# Altium schematic sheet Power_management.SchDoc
size A
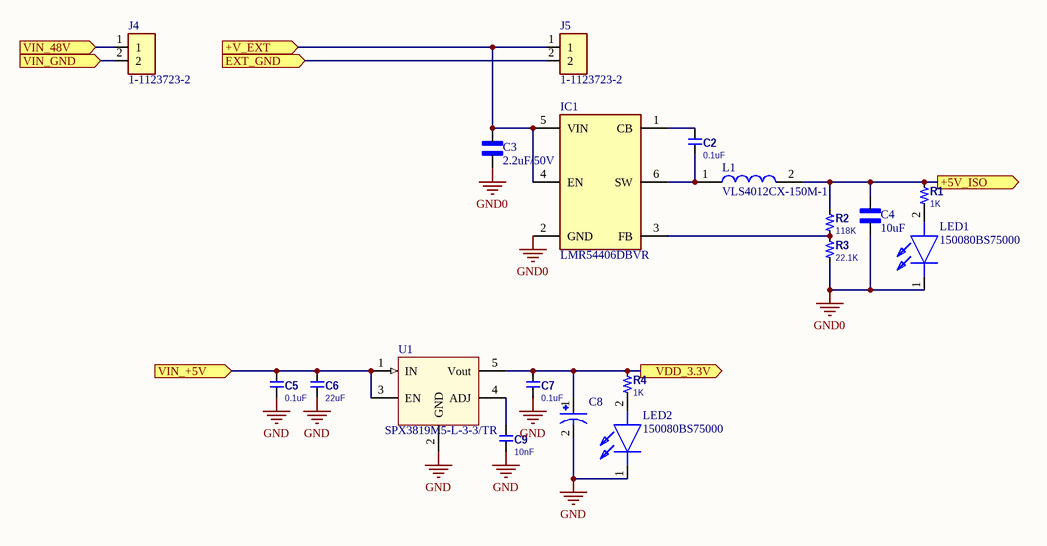
[diagram p0: Power_management.SchDoc]

## Parts
C2  0.1uF  [0603-C]
C3  2.2uF/50V  [0805_C]
C4  10uF  [0805_C]
C5  0.1uF  [0603-C]
C6  22uF  [0603-C]
C7  0.1uF  [0603-C]
C8  T493X227K010BH6420_220uF  [CAPPM7343X430N]  (value not drawn)
C9  10nF  [0603-C]
IC1  LMR54406DBVR  [SOT95P280X145-6N]
J4  1-1123723-2  [TE_1-1123723-2]
J5  1-1123723-2  [TE_1-1123723-2]
L1  VLS4012CX-150M-1  [VLS4012]
LED1  150080BS75000  [LEDC2012X80N]
LED2  150080BS75000  [LEDC2012X80N]
R1  1K  [0603-R]
R2  118K  [0603-R]
R3  22.1K  [0603-R]
R4  1K  [0603-R]
U1  SPX3819M5-L-3-3/TR  [SOT23-5]

## Ports
+5V_ISO (out), +V_EXT (in), EXT_GND (in), VDD_3.3V (out), VIN_48V (in), VIN_+5V (in), VIN_GND (in)

## Nets
GND: C5.2 C6.2 C7.2 C8.2 C9.2 LED2.1(K) U1.2(GND)
GND0: C3.2 C4.2 IC1.2(GND) LED1.1(K) R3.1
+5V_ISO: C4.1 L1.2 R1.2 R2.2 ; port +5V_ISO
+V_EXT: C3.1 IC1.4(EN) IC1.5(VIN) J5.1 ; port +V_EXT
EXT_GND: J5.2 ; port EXT_GND
VDD_3.3V: C7.1 C8.1 R4.2 U1.5(Vout) ; port VDD_3.3V
VIN_48V: J4.1 ; port VIN_48V
VIN_+5V: C5.1 C6.1 U1.1(IN) U1.3(EN) ; port VIN_+5V
VIN_GND: J4.2 ; port VIN_GND
NetC2_1: C2.1 IC1.1(CB)
NetC2_2: C2.2 IC1.6(SW) L1.1
NetC9_1: C9.1 U1.4(ADJ)
NetIC1_3: IC1.3(FB) R2.1 R3.2
NetLED1_2: LED1.2(A) R1.1
NetLED2_2: LED2.2(A) R4.1

## Library data of the parts
C2 C5-C7 C9 = CAP: Manufacturer: TDK EPCOS; Manufacturer Part Number: B37941K9105K62; Capacitance: 1uF; Voltage Rating: 16V; Tolerance: 10%; ComponentLink1URL: https://datasheet.ciiva.com/13389/upy-gphc-y5v-6-3v-to-50v-5-13389978.pdf?src-supplier=Mouser; ComponentLink1Description: Datasheet; Supplier 1: Digi-Key; RoHS: Yes; Category: Ceramic Capacitors; Mount: Surface Mount; Case/Package: 0805; Case Code (Metric): 2012; Case Code (Imperial): 0805; Min Operating Temperature: -55°C; Max Operating Temperature: 125°C; Package Quantity: 3000; Packaging: Tape and Reel; Voltage Rating (DC): 16V; Length: 0.079inch; Width: 0.049inch; Height: 1.35mm; Thickness: 0.049inch; Ratings: AEC-Q200; Lead Free: Lead Free; ComponentLink2URL: http://components.arrow.com/part/dataview/0323_01879911?src-supplier=Arrow+Europe; ComponentLink2Description: http://components.arrow.com/part/dataview/0323_01879911?src-supplier=Arrow+Europe; ComponentLink3URL: https://media.digikey.com/pdf/Data%20Sheets/Epcos%20PDFs/B37872K_B37941K_Series.pdf?src-supplier=Digi-Key; ComponentLink3Description: https://media.digikey.com/pdf/Data%20Sheets/Epcos%20PDFs/B37872K_B37941K_Series.pdf?src-supplier=Digi-Key; Supplier Part Number 1: 495-1935-1-ND
C3 C4 = CAP: MP: LD03ZD475MAB2A; Package: None; Price: None; Value: *; Availability: Unavailable
C8 = T493X227K010BH6420_220uF: MF: Kemet; Value: *; MP: T493X227K010BH6420; Package: SMD-2 Kemet; Availability: In Stock; Check_prices: https://www.snapeda.com/parts/T493X227K010BH6420/Kemet/view-part/?ref=eda; SnapEDA_Link: https://www.snapeda.com/parts/T493X227K010BH6420/Kemet/view-part/?ref=snap; Price: None
IC1 = LMR54406DBVR: Integrated Circuit; Manufacturer_Name: Texas Instruments; Datasheet Link: https://www.ti.com/lit/ds/symlink/lmr54406.pdf?ts=1659688249350&ref_url=https%253A%252F%252Fwww.ti.com%252Fproduct%252FLMR54406%252Fpart-details%252FLMR54406DBVR; Height: 1.45mm; Manufacturer_Part_Number: LMR54406DBVR; Mouser Part Number: 595-LMR54406DBVR; Mouser Price/Stock: https://www.mouser.co.uk/ProductDetail/Texas-Instruments/LMR54406DBVR?qs=rSMjJ%252B1ewcQLNU8KVBwgHQ%3D%3D; Arrow Part Number: LMR54406DBVR; Arrow Price/Stock: https://www.arrow.com/en/products/lmr54406dbvr/texas-instruments?region=nac
J4 J5 = 1-1123723-2: 3.96 EP HDR ASSY 2P_NATURAL_; Number_of_Positions: 2; MF: TE Connectivity; Product_Type: Header; Centerline_Pitch: 3.96 mm[.156 in]; EU_RoHS_Compliance: Compliant; Value: *; TE_purchase_URL: https://www.te.com/usa-en/product-1-1123723-2.html?te_bu=Cor&te_type=disp&te_campaign=seda_glo_cor-seda-global-disp-prtnr-fy19-seda-model-bom-cta_sma-317_1&elqCampaignId=32493; SnapEDA_Link: https://www.snapeda.com/parts/1-1123723-2/TE%20Connectivity%20AMP%20Connectors/view-part/231687/?ref=snap; Package: None; MP: 1-1123723-2; Digi-Key_Purchase_URL: https://www.digikey.com/product-detail/en/te-connectivity-amp-connectors/1-1123723-2/A111830-ND/686925?utm_source=snapeda&utm_medium=aggregator&utm_campaign=symbol; Digi-Key_Part_Number: A111830-ND
L1 = VLS4012CX-150M-1: Inductor; Manufacturer_Name: TDK; Datasheet Link: https://product.tdk.com/system/files/dam/doc/product/inductor/inductor/smd/catalog/inductor_commercial_power_vls4012cx-1_en.pdf; Manufacturer_Part_Number: VLS4012CX-150M-1; Mouser Part Number: 810-VLS4012CX150M1; Mouser Price/Stock: https://www.mouser.co.uk/ProductDetail/TDK/VLS4012CX-150M-1?qs=sPbYRqrBIVl6JuB3PiTP7w%3D%3D
LED1 LED2 = 150080BS75000: LED; Manufacturer_Name: Wurth Elektronik; Datasheet Link: https://katalog.we-online.com/led/datasheet/150080BS75000.pdf; Height: 0.8mm; Manufacturer_Part_Number: 150080BS75000; Mouser Part Number: 710-150080BS75000; Mouser Price/Stock: https://www.mouser.co.uk/ProductDetail/Wurth-Elektronik/150080BS75000?qs=2kOmHSv6VfT2tBo3UPVqAQ%3D%3D
R1-R4 = Res_2: Manufacturer: Panasonic; Manufacturer Part Number: ERJ-8GEYJ621V; Resistance: 620R; Tolerance: 5%; Voltage Rating: 200V; Temperature Coefficient: 200ppm/°C; Max Power Dissipation: 250mW; ComponentLink1URL: https://datasheet.ciiva.com/15193/getdatasheetpartid-366470-15193725.pdf?src-supplier=Verical; ComponentLink1Description: Datasheet; Supplier 1: Avnet; Stock 1: 6255; Pricing 1: 1 = 0.01200 (USD); RoHS: Yes; Mount: Surface Mount; Case Code (Metric): 3216; Case Code (Imperial): 1206; Contact Plating: Tin; Min Operating Temperature: -55°C; Max Operating Temperature: 155°C; Packaging: Tape and Reel; Package Quantity: 1; Resistor Type: Thick Film; Number of Terminations: 2; Voltage Rating (DC): 200V; Features: Automotive AEC-Q200; Series: ERJ; Construction: Rectangular; Resistance Tolerance: 5%; Length: 3.2mm; Width: 0.063inch; Height: 0.028inch; Depth: 1.6mm; Radiation Hardening: No; REACH SVHC: No SVHC; Military Standard: Not; Lead Free: Lead Free; RoHS Compliant: Yes; ComponentLink2URL: https://datasheet.ciiva.com/46387/1500035-46387094.pdf?src-supplier=Element14; ComponentLink2Description: https://datasheet.ciiva.com/46387/1500035-46387094.pdf?src-supplier=Element14; ComponentLink3URL: https://datasheet.ciiva.com/5915/1500035-5915369.pdf?src-supplier=Farnell; ComponentLink3Description: https://datasheet.ciiva.com/5915/1500035-5915369.pdf?src-supplier=Farnell; ComponentLink4URL: https://datasheet.ciiva.com/28677/1678796-28677018.pdf?src-supplier=Element14; ComponentLink4Description: https://datasheet.ciiva.com/28677/1678796-28677018.pdf?src-supplier=Element14; ComponentLink5URL: https://datasheet.ciiva.com/17204/aoa0000ce1-17204972.pdf?src-supplier=Avnet+Europe; ComponentLink5Description: https://datasheet.ciiva.com/17204/aoa0000ce1-17204972.pdf?src-supplier=Avnet+Europe; ComponentLink6URL: https://datasheet.ciiva.com/16515/aoa0000ce1-16515933.pdf?src-supplier=Avnet+Asia; ComponentLink6Description: https://datasheet.ciiva.com/16515/aoa0000ce1-16515933.pdf?src-supplier=Avnet+Asia; Supplier Part Number 1: 65T8955; Power Rating: 250mW; Case/Package: 0603
U1 = SPX3819: Linear Voltage Regulator IC 1 Output 500mA SOT-23-5; MF: MaxLinear, Inc.; SnapEDA_Link: https://www.snapeda.com/parts/SPX3819/MaxLinear,%20Inc./view-part/885098/?ref=snap; Package: SOT-23-5 MaxLinear, Inc.; Availability: Unavailable; Price: None; MP: SPX3819; Value: *